# EAGLE design Arduboy (EAGLE 7.2.0)
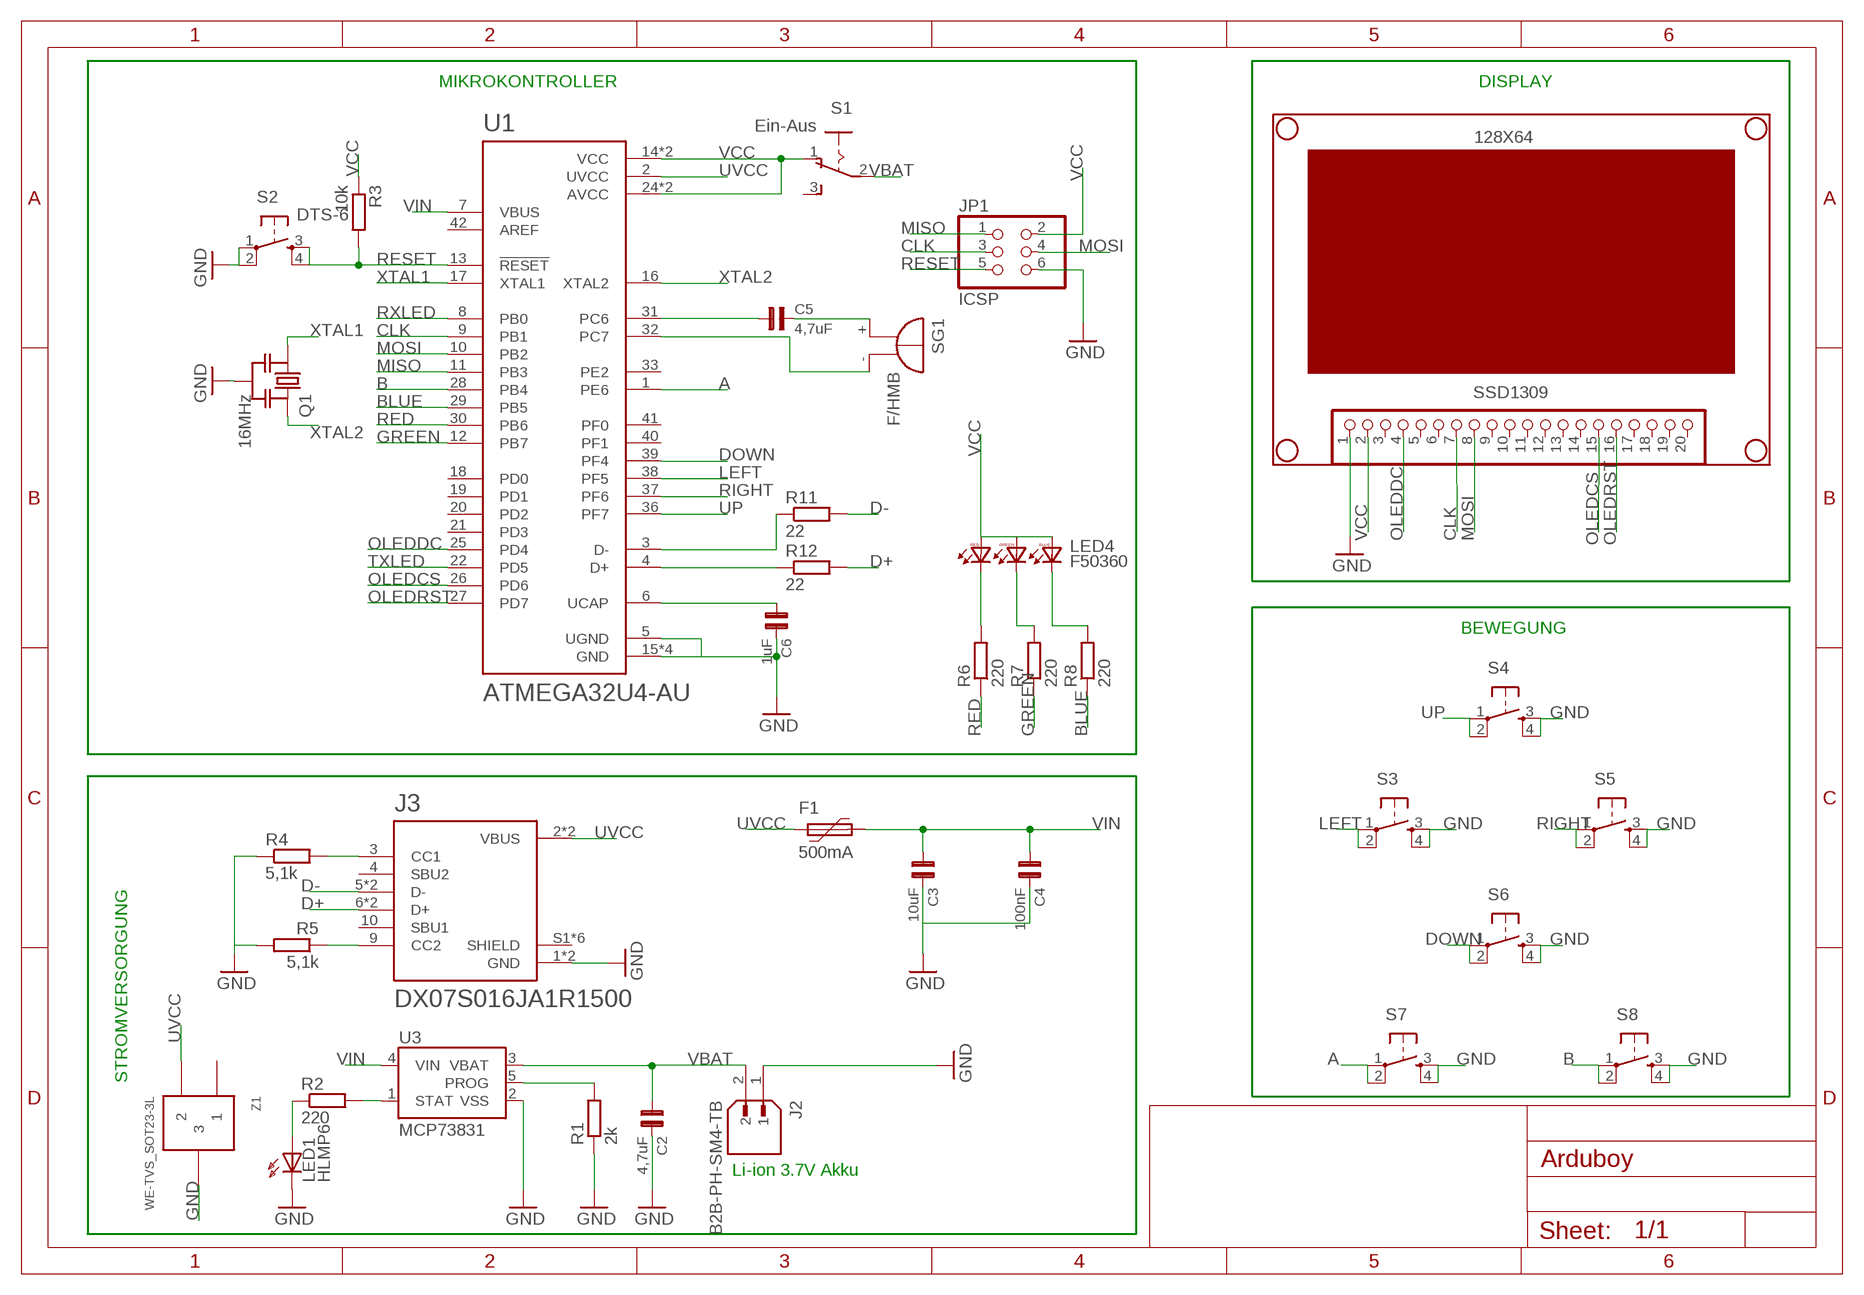
[diagram p0: schematic, sheet 1]

## Parts
128X64  SSD1309  PINHD-1X20  [1X20]
C2  4,7uF  C0204  [0204]
C3  10uF  C0204  [0204]
C4  100nF  C0204  [0204]
C5  4,7uF  C0204  [0204]
C6  1uF  C0204  [0204]
F1  500mA  MF-R055-5,1  [MF-5,1]
J2  B2B-PH-SM4-TB  [JST_B2B-PH-SM4-TB]
J3  DX07S016JA1R1500  [JAE_DX07S016JA1R1500]
JP1  ICSP  PINHD-2X3  [2X03]
LED1  HLMP6  [HLMP6]
LED4  F50360  [F50360]
Q1  16MHz  RESONATOR-MURATACSTCR_G  [RESONATOR_MURATA3]
R1  2k  R-EU_M0805  [M0805]
R2  220  R-EU_M0805  [M0805]
R3  10k  R-EU_M0805  [M0805]
R4  5,1k  R-EU_M0805  [M0805]
R5  5,1k  R-EU_M0805  [M0805]
R6  220  R-EU_M0805  [M0805]
R7  220  R-EU_M0805  [M0805]
R8  220  R-EU_M0805  [M0805]
R11  22  R-EU_M0805  [M0805]
R12  22  R-EU_M0805  [M0805]
S1  Ein-Aus  255SB  [255SB]
S2  DTS-6  [DTS-6]
S3  TAC_SWITCHPTH  [TACTILE-PTH]
S4  TAC_SWITCHPTH  [TACTILE-PTH]
S5  TAC_SWITCHPTH  [TACTILE-PTH]
S6  TAC_SWITCHPTH  [TACTILE-PTH]
S7  TAC_SWITCHPTH  [TACTILE-PTH]
S8  TAC_SWITCHPTH  [TACTILE-PTH]
SG1  F/HMB  [F/HMB]
U1  ATMEGA32U4-AU  [QFP80P1200X1200X120-44N]
U3  MCP73831  [SOT23-5]
Z1  WE-TVS_SOT23-3L  [WE-TVS_SOT23-3L]

## Nets
A: S7.1 S7.2 U1.1(PE6)
B: S8.1 S8.2 U1.28(PB4)
BLUE: R8.1 U1.29(PB5)
CLK: 128X64.7 JP1.3 U1.9(PB1)
D+: J3.6(D+) J3.7(D+) R12.2
D-: J3.5(D-) J3.8(D-) R11.2
DOWN: S6.1 S6.2 U1.39(PF4)
GND: 128X64.1 C2.2 C3.2 C4.2 C6.2 J2.1 J3.1(GND) J3.12(GND) JP1.6 LED1.K Q1.2 R1.1 R4.1 R5.2 S2.1 S2.2 S3.3 S3.4 S4.3 S4.4 S5.3 S5.4 S6.3 S6.4 S7.3 S7.4 S8.3 S8.4 U1.5(UGND) U1.15(GND) U1.23(GND) U1.35(GND) U1.43(GND) U3.2(VSS) Z1.3
GREEN: R7.1 U1.12(PB7)
LEFT: S3.1 S3.2 U1.38(PF5)
MISO: JP1.1 U1.11(PB3)
MOSI: 128X64.8 JP1.4 U1.10(PB2)
N$1: R12.1 U1.4(D+)
N$2: R11.1 U1.3(D-)
N$3: R1.2 U3.5(PROG)
N$4: R2.2 U3.1(STAT)
N$5: LED1.A R2.1
N$6: C5.1 U1.31(PC6)
N$8: SG1.- U1.32(PC7)
N$9: C5.2 SG1.+
N$10: J3.9(CC2) R5.1
N$12: LED4.RC R6.2
N$13: LED4.GC R7.2
N$14: LED4.BC R8.2
N$23: C6.1 U1.6(UCAP)
N$24: J3.3(CC1) R4.2
OLEDCS: 128X64.15 U1.26(PD6)
OLEDDC: 128X64.4 U1.25(PD4)
OLEDRST: 128X64.16 U1.27(PD7)
RED: R6.1 U1.30(PB6)
RESET: JP1.5 R3.2 S2.3 S2.4 U1.13(!RESET)
RIGHT: S5.1 S5.2 U1.37(PF6)
RXLED: U1.8(PB0)
TXLED: U1.22(PD5)
UP: S4.1 S4.2 U1.36(PF7)
UVCC: F1.1 J3.2(VBUS) J3.11(VBUS) U1.2(UVCC) Z1.2
VBAT: C2.1 J2.2 S1.2(P) U3.3(VBAT)
VCC: 128X64.2 JP1.2 LED4.BA LED4.GA LED4.RA R3.1 S1.1(O) U1.14(VCC) U1.24(AVCC) U1.34(VCC) U1.44(AVCC)
VIN: C3.1 C4.1 F1.2 U1.7(VBUS) U3.4(VIN)
XTAL1: Q1.1 U1.17(XTAL1)
XTAL2: Q1.3 U1.16(XTAL2)
Unconnected: 128X64.3 128X64.5 128X64.6 128X64.9 128X64.10 128X64.11 128X64.12 128X64.13 128X64.14 128X64.17 128X64.18 128X64.19 128X64.20 J3.4(SBU2) J3.10(SBU1) J3.S1(SHIELD) J3.S2(SHIELD) J3.S3(SHIELD) J3.S4(SHIELD) J3.S5(SHIELD) J3.S6(SHIELD) S1.3(S) U1.18(PD0) U1.19(PD1) U1.20(PD2) U1.21(PD3) U1.33(PE2) U1.40(PF1) U1.41(PF0) U1.42(AREF) Z1.1

## Notes on the sheet
- MIKROKONTROLLER | DISPLAY
- BEWEGUNG
- STROMVERSORGUNG
- Li-ion 3.7V Akku

## Library data of the parts
128X64 = pinhead4:PINHD-1X20: PIN HEADER; HEIGHT: 8
C2-C6 = capsmd:C0204: smallest SMD capacitor
F1 = bourns:MF-R055: MultiFuse Polyfuse Overcurrent Protectors
J2 = B2B-PH-SM4-TB:B2B-PH-SM4-TB: Check availability <https://pricing.snapeda.com/parts/B2B-PH-SM4-TB/JST/view-part?ref=eda>; AVAILABILITY: In Stock; CHECK_PRICES: https://www.snapeda.com/parts/B2B-PH-SM4-TB/JST/view-part/?ref=eda; DESCRIPTION: Connector Header Surface Mount 2 position 0.079 (2.00mm); HEIGHT: 5; MF: JST; MP: B2B-PH-SM4-TB; PACKAGE: NON STANDARD-2 JST; PRICE: None; PURCHASE-URL: https://www.snapeda.com/api/url_track_click_mouser/?unipart_id=4817258&manufacturer=JST&part_name=B2B-PH-SM4-TB&search_term=jst ph 2mm; SNAPEDA_LINK: https://www.snapeda.com/parts/B2B-PH-SM4-TB/JST/view-part/?ref=snap
J3 = DX07S016JA1R1500:DX07S016JA1R1500: Check availability <https://pricing.snapeda.com/parts/DX07S016JA1R1500/JAE%20Electronics/view-part?ref=eda>; AVAILABILITY: In Stock; CHECK_PRICES: https://www.snapeda.com/parts/DX07S016JA1R1500/JAE+Electronics/view-part/?ref=eda; DESCRIPTION: USB-C (USB TYPE-C) USB 2.0 Receptacle Connector 24 (16+8 Dummy) Position Surface Mount, Right Angle; Through Hole; HEIGHT: 4; MF: JAE Electronics; MP: DX07S016JA1R1500; PACKAGE: None; PRICE: None; PURCHASE-URL: https://www.snapeda.com/api/url_track_click_mouser/?unipart_id=4551013&manufacturer=JAE Electronics&part_name=DX07S016JA1R1500&search_term=jae, gewinkelt dx usb-steckverbinder buchse usb typ c 1, oberfläche usb 2.0; SNAPEDA_LINK: https://www.snapeda.com/parts/DX07S016JA1R1500/JAE+Electronics/view-part/?ref=snap
JP1 = pinhead:PINHD-2X3: PIN HEADER; HEIGHT: 5
LED1 = display-hp:HLMP6: LED 2mm horizontal; HEIGHT: 4; MF: AGILENT TECHNOLOGIES; MPN: HLMP-6500; OC_FARNELL: 1652490; OC_NEWARK: 40K0088
LED4 = led:F50360: Full color Z-Power LED RGB P5-II Series Source: http://www.seoulsemicon.co.kr .. F50360.pdf
Q1 = m-pad-2.1:RESONATOR-MURATA: Murata ceramic Resonator "ceralock" CSTCE series with built in load capacitance +- 0.5% tolerance 12.51MHz to 19.99MHz 16MHz murata part#: CSTCE16M0V53-R0 16MHz digikey part#: 490-1198-1-ND $1.33 each
R1-R8 R11 R12 = rcl:R-EU_: RESISTOR, European symbol
S1 = switch:255SB: SLIDING SWITCH Distributor Buerklin, 11G810
S2 = switch-tact:DTS-6; HEIGHT: 7
S3-S8 = SparkFun-Electromechanical:TAC_SWITCH: Momentary Switch Button commonly used for reset or general input. Spark Fun Electronics SKU : COM-00097; HEIGHT: 5
SG1 = buzzer:F/HMB: BUZZER Source: Buerklin; HEIGHT: 8; OC_FARNELL: unknown; OC_NEWARK: unknown
U1 = ATMEGA32U4-AU:ATMEGA32U4-AU: Check availability <https://pricing.snapeda.com/parts/ATMEGA32U4-AU/Microchip%20Technology/view-part?ref=eda>; AVAILABILITY: In Stock; CHECK_PRICES: https://www.snapeda.com/parts/ATMEGA32U4-AU/Microchip+Technology/view-part/?ref=eda; DESCRIPTION: Microcontroller, USB controller 16/32K of ISP flash, TQFP44 industrial, 8-bit | Microchip Technology Inc. ATMEGA32U4-AU; MF: Microchip Technology; MP: ATMEGA32U4-AU; PACKAGE: TQFP-44 Microchip; PRICE: None; PURCHASE-URL: https://www.snapeda.com/api/url_track_click_mouser/?unipart_id=4247446&manufacturer=Microchip Technology&part_name=ATMEGA32U4-AU&search_term=atmega32u4; SNAPEDA_LINK: https://www.snapeda.com/parts/ATMEGA32U4-AU/Microchip+Technology/view-part/?ref=snap
U3 = SparkFun-PowerIC:MCP73831: Miniature single cell, fully integrated Li-Ion, Li-polymer charge management controller http://ww1.microchip.com/downloads/en/DeviceDoc/21984a.pdf
Z1 = wuerth_elektronik_eisos__v6.0:WE-TVS_SOT23-3L: TVS Diode Array WE-TVS - Low capazity - No leakage current - Low clamping voltage - high ESD voltage protection - Uni- and bidirectional protection -- USB 2.0 -- IEEE1394 -- LAN 1GBit -- DVI -- HDMI

## Board
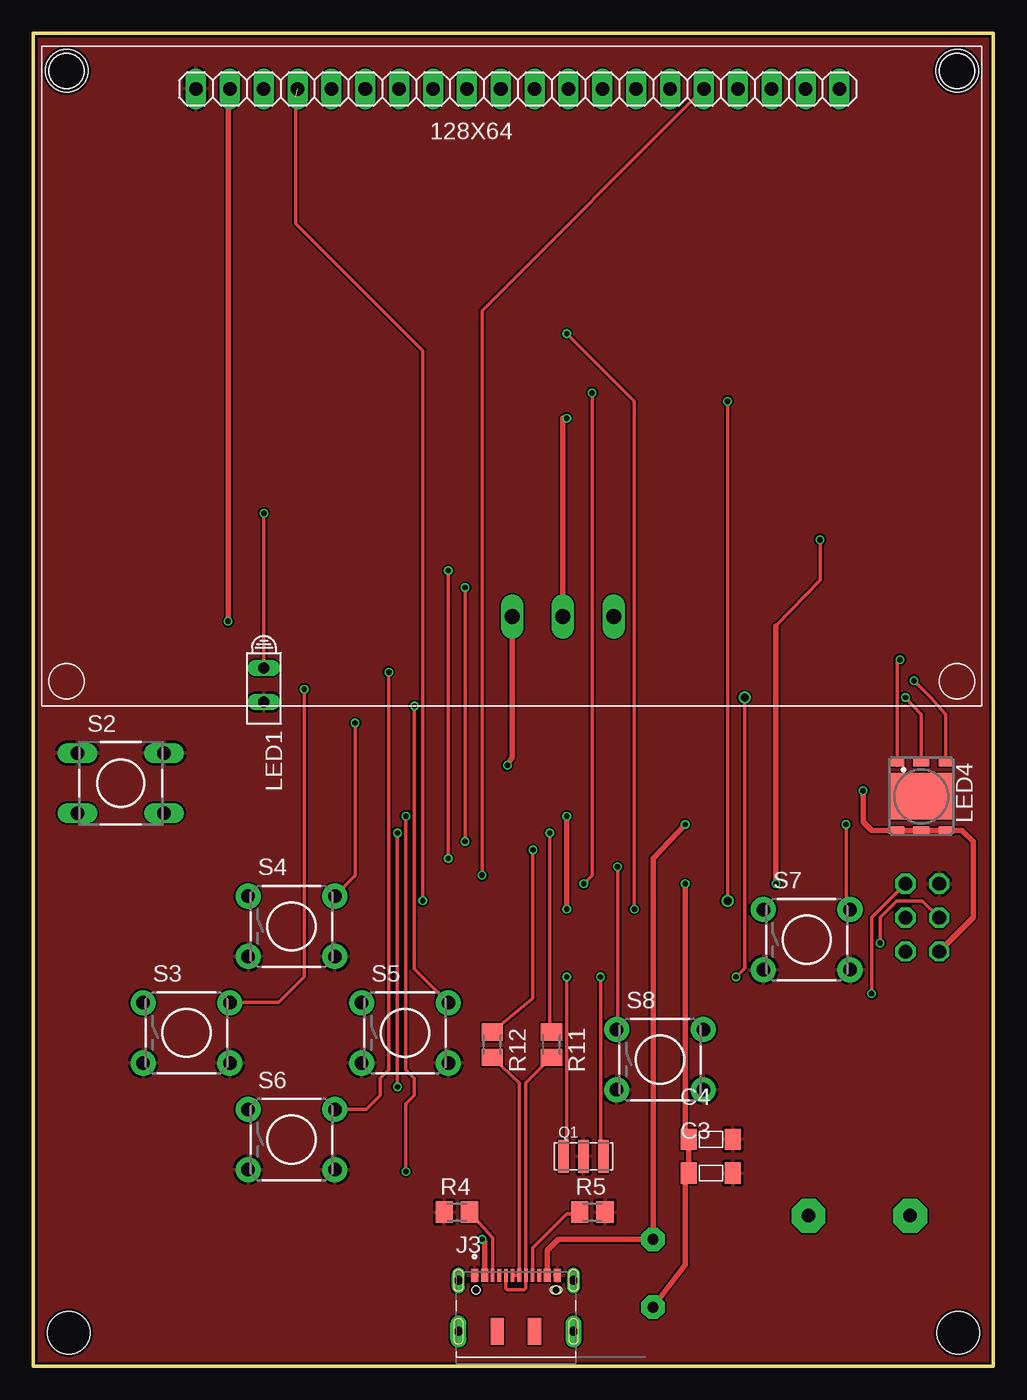
[diagram p1: board, top side]
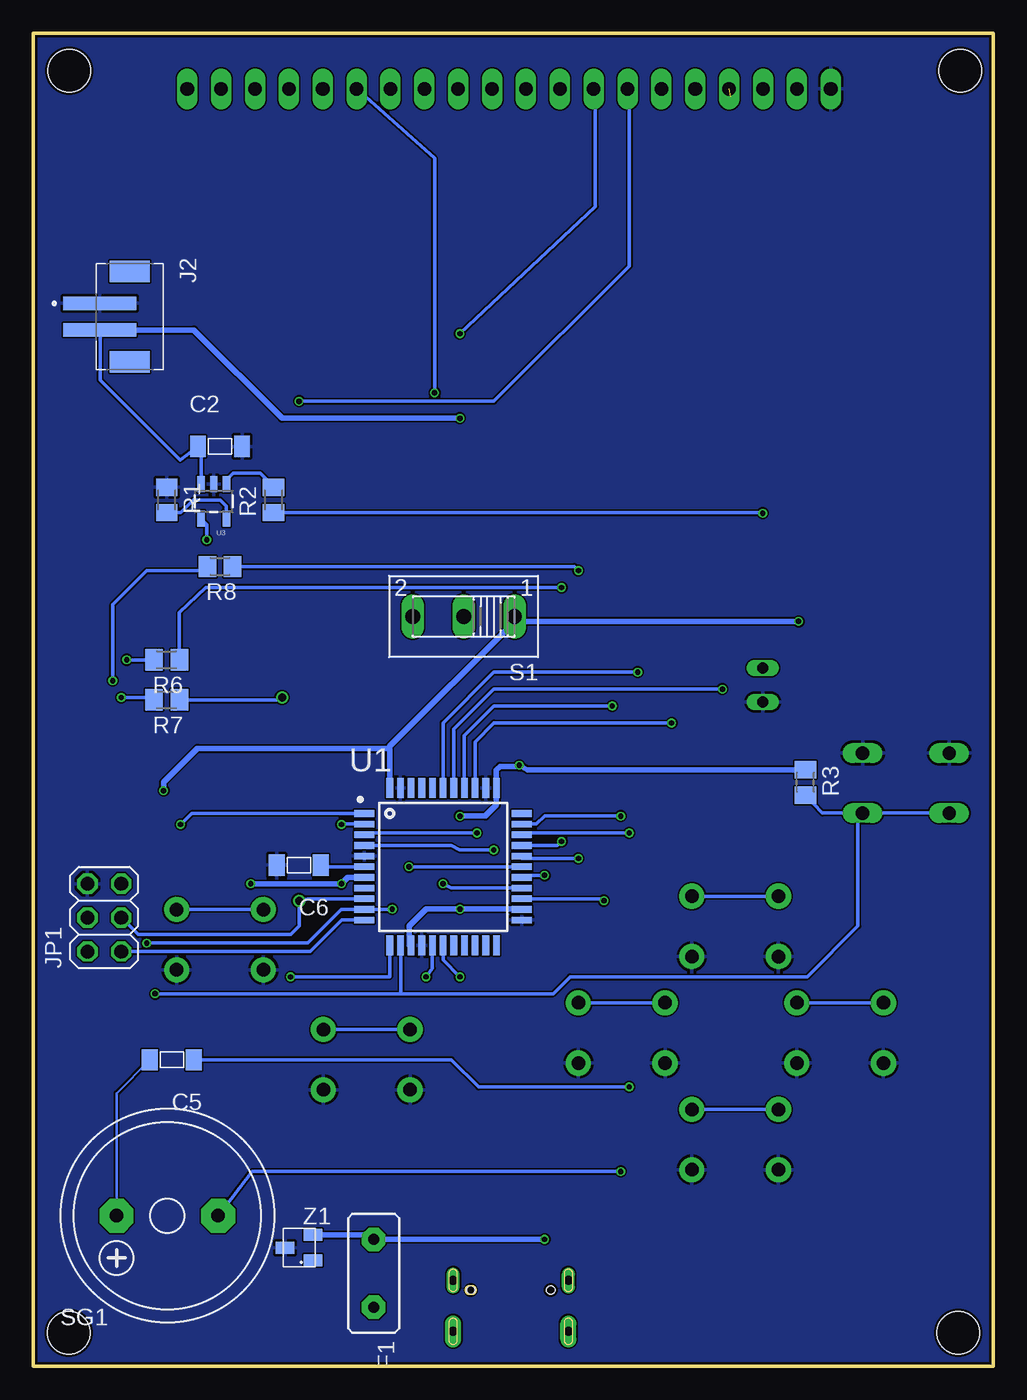
[diagram p2: board, bottom side, seen from below]

Size 72 x 100 mm. Coordinates in mm from the lower left corner, seen from the top.
Outline: 72,0 72,100 0,100 0,0 72,0
Copper layers (1*16): Top 0.018mm / dielectric 1.55mm / Bottom 0.018mm
Design rules "Multi-CB_2L_125um-Tracks_OL35um": minimum track width 0.125mm, minimum drill 0.2mm, track to track 0.125mm, track to pad 0.125mm, pad to pad 0.125mm, via to via 0.125mm, smd to smd 0mil, copper to edge 0.2mm, drill to drill 0.2mm, minimum pad ring 0.125mm, minimum via ring 0.125mm, stop-mask expansion 2mil, vias tented up to drill 0.45mm, thermal gap 0.2mm
Holes 3.2 mm at 2.65,2.5 69.35,2.5 69.3,97.2 2.5,97.2

### Footprints (pad centres in the part's own frame; a part is rotated, then mirrored left to right if it is on the bottom)
1X20 = drill 1.016 long: 1 11.56,46.3; 2 14.1,46.3; 3 16.64,46.3; 4 19.18,46.3; 5 21.72,46.3; 6 24.26,46.3; 7 26.8,46.3; 8 29.34,46.3; 9 31.88,46.3; 10 34.42,46.3; 11 36.96,46.3; 12 39.5,46.3; 13 42.04,46.3; 14 44.58,46.3; 15 47.12,46.3; 16 49.66,46.3; 17 52.2,46.3; 18 54.74,46.3; 19 57.28,46.3; 20 59.82,46.3
0204 = smd 1.194 x 1.6: 1 -1.651,0; 2 1.651,0
MF-5,1 = drill 0.813 pad 1.778 octagon: 1 -2.54,0; 2 2.54,0
JST_B2B-PH-SM4-TB = smd 1 x 5.5: 1 -1,-2.25; 2 1,-2.25 | smd 1.6 x 3: S1 -3.4,0; S2 3.4,0
JAE_DX07S016JA1R1500 = smd 0.52 x 1: 1 -3.1,1.1; 2 -2.35,1.1; 11 2.35,1.1; 12 3.1,1.1 | smd 0.27 x 1: 3 -1.75,1.1; 4 -1.25,1.1; 5 -0.75,1.1; 6 -0.25,1.1; 7 0.25,1.1; 8 0.75,1.1; 9 1.25,1.1; 10 1.75,1.1 | smd 1 x 2: S1 -1.4,-3.1; S2 1.4,-3.1 | drill 0.65 long: S3 -4.32,0.725; S4 4.32,0.725 | drill 0.65 pad 1.2 long: S5 -4.32,-3.1; S6 4.32,-3.1 | hole 0.6: 3,0 | hole 0.63: 3,0; -3,0
2X03 = drill 1.016 octagon: 1 -2.54,-1.27; 2 -2.54,1.27; 3 0,-1.27; 4 0,1.27; 5 2.54,-1.27; 6 2.54,1.27
HLMP6 = drill 0.813 long: A -1.27,0; K 1.27,0
F50360 = smd 0.6 x 1.05: BA 2.55,1.825; BC -2.55,1.825; RA 2.55,-1.825; RC -2.55,-1.825 | smd 0.6 x 1.2: GA 2.55,0; GC -2.55,0 | smd 3.5 x 4.7: NC 0,0
RESONATOR_MURATA3 = smd 0.8 x 2.5: 1 -1.5,0; 2 0,0; 3 1.5,0
M0805 = smd 1.3 x 1.6: 1 -0.95,0; 2 0.95,0
255SB = drill 1.118 long: 1 -3.81,0; 2 0,0; 3 3.81,0
DTS-6 = drill 1 long: 1 -3.25,2.25; 2 3.25,2.25; 3 -3.25,-2.25; 4 3.25,-2.25
TACTILE-PTH = drill 1.016 pad 1.88: 1 -3.251,2.261; 2 3.251,2.261; 3 -3.251,-2.261; 4 3.251,-2.261
F/HMB = drill 1.016 pad 2.54 octagon: + 3.81,0; - -3.81,0
QFP80P1200X1200X120-44N = smd 1.5 x 0.5: 1 -5.9,4; 2 -5.9,3.2; 3 -5.9,2.4; 4 -5.9,1.6; 5 -5.9,0.8; 6 -5.9,0; 7 -5.9,-0.8; 8 -5.9,-1.6; 9 -5.9,-2.4; 10 -5.9,-3.2; 11 -5.9,-4; 23 5.9,-4; 24 5.9,-3.2; 25 5.9,-2.4; 26 5.9,-1.6; 27 5.9,-0.8; 28 5.9,0; 29 5.9,0.8; 30 5.9,1.6; 31 5.9,2.4; 32 5.9,3.2; 33 5.9,4 | smd 0.5 x 1.5: 12 -4,-5.9; 13 -3.2,-5.9; 14 -2.4,-5.9; 15 -1.6,-5.9; 16 -0.8,-5.9; 17 0,-5.9; 18 0.8,-5.9; 19 1.6,-5.9; 20 2.4,-5.9; 21 3.2,-5.9; 22 4,-5.9; 34 4,5.9; 35 3.2,5.9; 36 2.4,5.9; 37 1.6,5.9; 38 0.8,5.9; 39 0,5.9; 40 -0.8,5.9; 41 -1.6,5.9; 42 -2.4,5.9; 43 -3.2,5.9; 44 -4,5.9
SOT23-5 = smd 0.55 x 1.2: 1 -0.95,-1.3; 2 0,-1.3; 3 0.95,-1.3; 4 0.95,1.3; 5 -0.95,1.3
WE-TVS_SOT23-3L = smd 0.9 x 1.4: 1 -0.95,-1.05; 2 0.95,-1.05; 3 0,1.05

### Placement (x,y rotation side)
128X64  0.64,49.53 0 top
C2  58,69 0 bottom
C3  50.81,14.48 0 top
C4  50.81,17.02 0 top
C5  61.61,22.98 180 bottom
C6  52.09,37.59 180 bottom
F1  46.48,6.97 270 bottom
J2  64.77,78.74 270 bottom
J3  36.2,5.71 0 top
JP1  66.67,33.66 90 bottom
LED1  17.29,51.1 270 top
LED4  66.61,42.76 270 top
Q1  41.26,15.75 0 top
R1  62,65 270 bottom
R2  54,65 90 bottom
R3  14.1,43.8 270 bottom
R4  31.77,11.55 0 top
R5  41.92,11.55 0 top
R6  62,53 180 bottom
R7  62,50 180 bottom
R8  58,60 180 bottom
R11  38.86,24.11 270 top
R12  34.41,24.11 270 top
S1  39.72,56.24 180 bottom
S2  6.56,43.75 0 top
S3  11.49,25 0 top
S4  19.36,33 0 top
S5  27.88,25 0 top
S6  19.36,17 0 top
S7  58,32 0 top
S8  47,23 0 top
SG1  61.95,11.29 180 bottom
U1  41.27,37.47 0 bottom
U3  58.47,64.88 180 bottom
Z1  52.07,8.89 90 bottom

### Tracks (layer width: path | path; a pad name or v marks a point on that pad's centre or on a via)
A  (via drill 0.4)
  Top 0.254: v60.96,40.64 60.96,34.26 S7.2
  Bottom 0.254: U1.1 60.13,41.47 v60.96,40.64 | S7.1 S7.2
B  (via drill 0.4)
  Top 0.254: v43.81,37.47 43.81,25.33 S8.1
  Bottom 0.254: U1.28 v43.81,37.47 | S8.2 S8.1
BLUE  (via drill 0.4)
  Top 0.254: v31.11,38.1 v31.11,59.69
  Bottom 0.254: U1.29 35.38,38.1 v31.11,38.1 | R8.1 31.43,60 v31.11,59.69
CLK  (via drill 0.4, 0.6)
  Top 0.254: v52.07,34.92 v52.07,72.39
  Bottom 0.254: U1.9 51.44,35.06 v52.07,34.92 52.07,33.02 52.7,32.38 64.14,32.38 JP1.3 | 128X64.7 27.3,95.7 27.3,82.55 37.47,72.39 v52.07,72.39
D+
  Top 0.254: J3.6 J3.7 36.45,21.26 R12.2
D-
  Top 0.254: J3.5 35.45,5.83 35.56,5.71 36.83,5.71 36.95,5.83 J3.8 36.95,21.26 R11.2
DOWN  (via drill 0.4)
  Top 0.254: v26.67,52.07 26.67,22.23 26.04,21.59 26.04,20.32 24.98,19.26 S6.2
  Bottom 0.254: U1.39 41.27,48.26 37.47,52.07 v26.67,52.07 | S6.1 S6.2
GND
  pour Bottom (isolate 0.127): -5,-5 -5,105 80,105 80,-5
  pour Top (isolate 0.127): -10,-10 -10,110 85,110 85,-10
GREEN  (via drill 0.4, 0.6)
  Top 0.254: v52.7,29.21 53.34,29.84 v53.34,50.16
  Bottom 0.254: U1.12 45.27,29.21 v52.7,29.21 | R7.1 53.51,50 v53.34,50.16
LEFT  (via drill 0.4)
  Top 0.254: v20.32,50.8 20.32,29.21 18.41,27.3 14.79,27.3 S3.2
  Bottom 0.254: U1.38 40.48,47.79 37.47,50.8 v20.32,50.8 | S3.1 S3.2
MISO
  Bottom 0.254: JP1.1 51.22,31.11 49.53,32.8 48.87,33.47 U1.11
MOSI  (via drill 0.4)
  Top 0.254: 29.84,95.83 128X64.8 | v63.5,31.75 63.5,33.66 64.77,34.92 66.67,34.92 JP1.4 | v45.09,34.29 45.09,72.39 v40.01,77.47
  Bottom 0.254: v45.09,34.29 45.09,34.27 U1.10 48.92,34.27 51.44,31.75 v63.5,31.75 | v40.01,77.47 29.84,87 29.84,95.7 128X64.8
N$1  (via drill 0.4)
  Top 0.254: R12.1 37.47,27.61 v37.47,38.73
  Bottom 0.254: U1.4 40.64,39.06 40.01,38.73 v37.47,38.73
N$2  (via drill 0.4)
  Top 0.254: R11.1 38.73,25.07 v38.73,40.01
  Bottom 0.254: v38.73,40.01 47.17,40.01 U1.3
N$3
  Bottom 0.254: R1.2 60.95,64.05 60,65 58,65 57.52,64.52 U3.5
N$4
  Bottom 0.254: U3.1 57.52,66.48 57,67 55,67 54,66 R2.2
N$5  (via drill 0.4)
  Top 0.254: v17.29,64 LED1.A
  Bottom 0.254: R2.1 17.34,64.05 v17.29,64
N$6  (via drill 0.4)
  Top 0.254: v27.3,40.01 v27.3,20.95
  Bottom 0.254: U1.31 35.38,40.01 v27.3,40.01 | C5.1 40.64,22.98 38.61,20.95 v27.3,20.95
N$8  (via drill 0.4)
  Top 0.254: v27.94,14.61 27.94,19.68 28.57,20.32 28.57,21.59 27.94,22.23 v27.94,41.27
  Bottom 0.254: SG1.- 55.6,14.61 v27.94,14.61 | v27.94,41.27 33.66,41.27 34.29,40.66 U1.32
N$9
  Bottom 0.2: SG1.+ 65.76,20.49 C5.2
N$10
  Top 0.254: J3.9 37.47,6.82 37.47,8.89 40.01,11.43 40.85,11.43 R5.1 40.98,11.43
N$12  (via drill 0.4)
  Top 0.254: 64.78,45.09 LED4.RC 64.78,52.78 v65,53
  Bottom 0.254: v65,53 R6.2
N$13  (via drill 0.4)
  Top 0.254: LED4.GC 66.61,48.9 v65.41,50.16
  Bottom 0.254: v65.41,50.16 63.12,50.16 R7.2
N$14  (via drill 0.4)
  Top 0.254: LED4.BC 68.43,48.9 67.31,50.16 v66.04,51.44
  Bottom 0.254: v66.04,51.44 66.04,57.15 63.5,59.69 59.26,59.69 R8.2
N$23
  Bottom 0.254: U1.6 50.31,37.47 C6.1
N$24
  Top 0.254: J3.3 34.45,9.65 R4.2
OLEDCS  (via drill 0.4)
  Top 0.254: v41.27,36.2 41.91,36.83 v41.91,73.03
  Bottom 0.254: U1.26 40.64,35.87 v41.27,36.2 | v41.91,73.03 41.91,90.62 128X64.15
OLEDDC  (via drill 0.4)  (1 unrouted)
  Top 0.254: v29.21,34.92 29.21,76.2 19.68,85.72 19.68,95.25 20.32,95.25
  Bottom 0.254: U1.25 29.35,35.06 arc90 v29.21,34.92
OLEDRST  (via drill 0.4)
  Top 0.254: v33.66,36.83 33.66,79.19 128X64.16 50.16,95.7
  Bottom 0.254: U1.27 35.38,36.83 v33.66,36.83
RED  (via drill 0.4)
  Top 0.254: v32.38,39.37 v32.38,58.42
  Bottom 0.254: v32.38,58.42 59.05,58.42 61.05,56.53 R6.1 | U1.30 32.69,39.06 v32.38,39.37
RESET  (via drill 0.4)
  Top 0.254: JP1.5 62.87,33.66 v62.87,27.94
  Bottom 0.254: 44.45,31.54 U1.13 44.45,31.57 44.45,27.94 | S2.4 12.82,41.5 R3.2 | v62.87,27.94 44.45,27.94 | 44.45,27.94 33.02,27.94 31.75,29.21 13.97,29.21 10.16,33.02 10.16,41.15 S2.4 | S2.3 S2.4
RIGHT  (via drill 0.4)
  Top 0.254: S5.2 28.57,29.8 28.57,33.66 v28.59,49.53
  Bottom 0.254: U1.37 39.67,47.32 37.47,49.53 v28.59,49.53 | S5.1 S5.2
UP  (via drill 0.4)
  Top 0.254: S4.2 24.13,36.83 v24.13,48.26
  Bottom 0.254: U1.36 38.88,46.85 37.47,48.26 v24.13,48.26 | S4.1 S4.2
UVCC  (via drill 0.4)
  Top 0.254: 46.47,9.53 F1.1 | 33.84,9.34 v33.66,9.53
  Top 0.406: F1.1 46.48,38.1 v48.9,40.64 | J3.11 38.55,8.7 39.37,9.53 46.47,9.53 | J3.2 33.84,9.34
  Bottom 0.254: v48.9,40.64 48.9,40.66 U1.2 | 46.47,9.53 F1.1 46.81,9.84
  Bottom 0.406: v33.66,9.53 46.47,9.53 | Z1.2 46.81,9.84
VBAT  (via drill 0.4)
  Top 0.254: v40.01,71.12 39.72,71.12
  Top 0.406: 39.72,71.12 S1.2
  Bottom 0.254: S1.2 | 67.31,77.45 J2.2 67,77.72 67,74 61,68 C2.1 59.42,68.77 U3.3
  Bottom 0.406: v40.01,71.12 53.34,71.12 59.96,77.74 J2.2
VCC  (via drill 0.4)
  Top 0.254: 128X64.2 14.61,95.83
  Top 0.406: v35.56,45.09 35.91,45.72 S1.1 | 14.61,95.83 v14.61,55.88 | v62.23,43.18 62.23,40.84 62.87,40.21 LED4.RA LED4.GA LED4.BA 69.64,40.21 70.48,39.37 70.48,33.66 JP1.2 | v40.01,34.29 v40.01,41.27
  Bottom 0.2: U1.34
  Bottom 0.254: 45.27,43.18 U1.44 | U1.24 35.38,34.29 | 43.81,31.57 U1.14 | 35.91,55.88 S1.1 | 35.65,45 v35.56,45.09 | 45.44,46.35 45.27,46.52
  Bottom 0.406: R3.1 34.92,44.75 v35.56,45.09 | v14.61,55.88 35.91,55.88 45.27,46.52 U1.44 | 35.38,34.29 v40.01,34.29 42.55,34.29 43.81,33.02 43.81,31.57 | U1.34 37.27,42.1 38.1,41.27 v40.01,41.27 | U1.34 37.27,44.73 37,45 35.65,45 | v62.23,43.18 62.23,43.81 59.69,46.35 45.44,46.35
VIN  (via drill 0.4)
  Top 0.254: F1.2 46.48,4.45 | 48.9,14.48 C3.1 | C4.1 49.16,17.14 48.9,17.14 | v59,62 59,59 55.69,55.52
  Top 0.406: 46.48,4.45 48.9,7.62 48.9,14.48 | C3.1 C4.1 | 48.9,17.14 v48.9,36.2 | 55.69,55.52 v55.69,36.2
  Bottom 0.254: v59,62 59,63.16 U3.4
  Bottom 0.406: v55.69,36.2 v48.9,36.2 48.42,36.66 U1.7
XTAL1  (via drill 0.4)
  Top 0.254: Q1.1 40.01,15.75 v40.01,29.21
  Bottom 0.254: v40.01,29.21 41.27,30.48 U1.17
XTAL2  (via drill 0.4)
  Top 0.254: Q1.3 42.55,15.75 v42.55,29.21
  Bottom 0.254: v42.55,29.21 42.08,29.84 U1.16

### Text on the board
225bmp: 3,7V Li-Ion Akku